# Altium schematic sheet USBINFRTransiever_Microcontroller.SchDoc
size 840 x 594 mm; DocumentNumber: ФНКЦ.542321.001 Э3; SheetNumber: 3; Format: A1
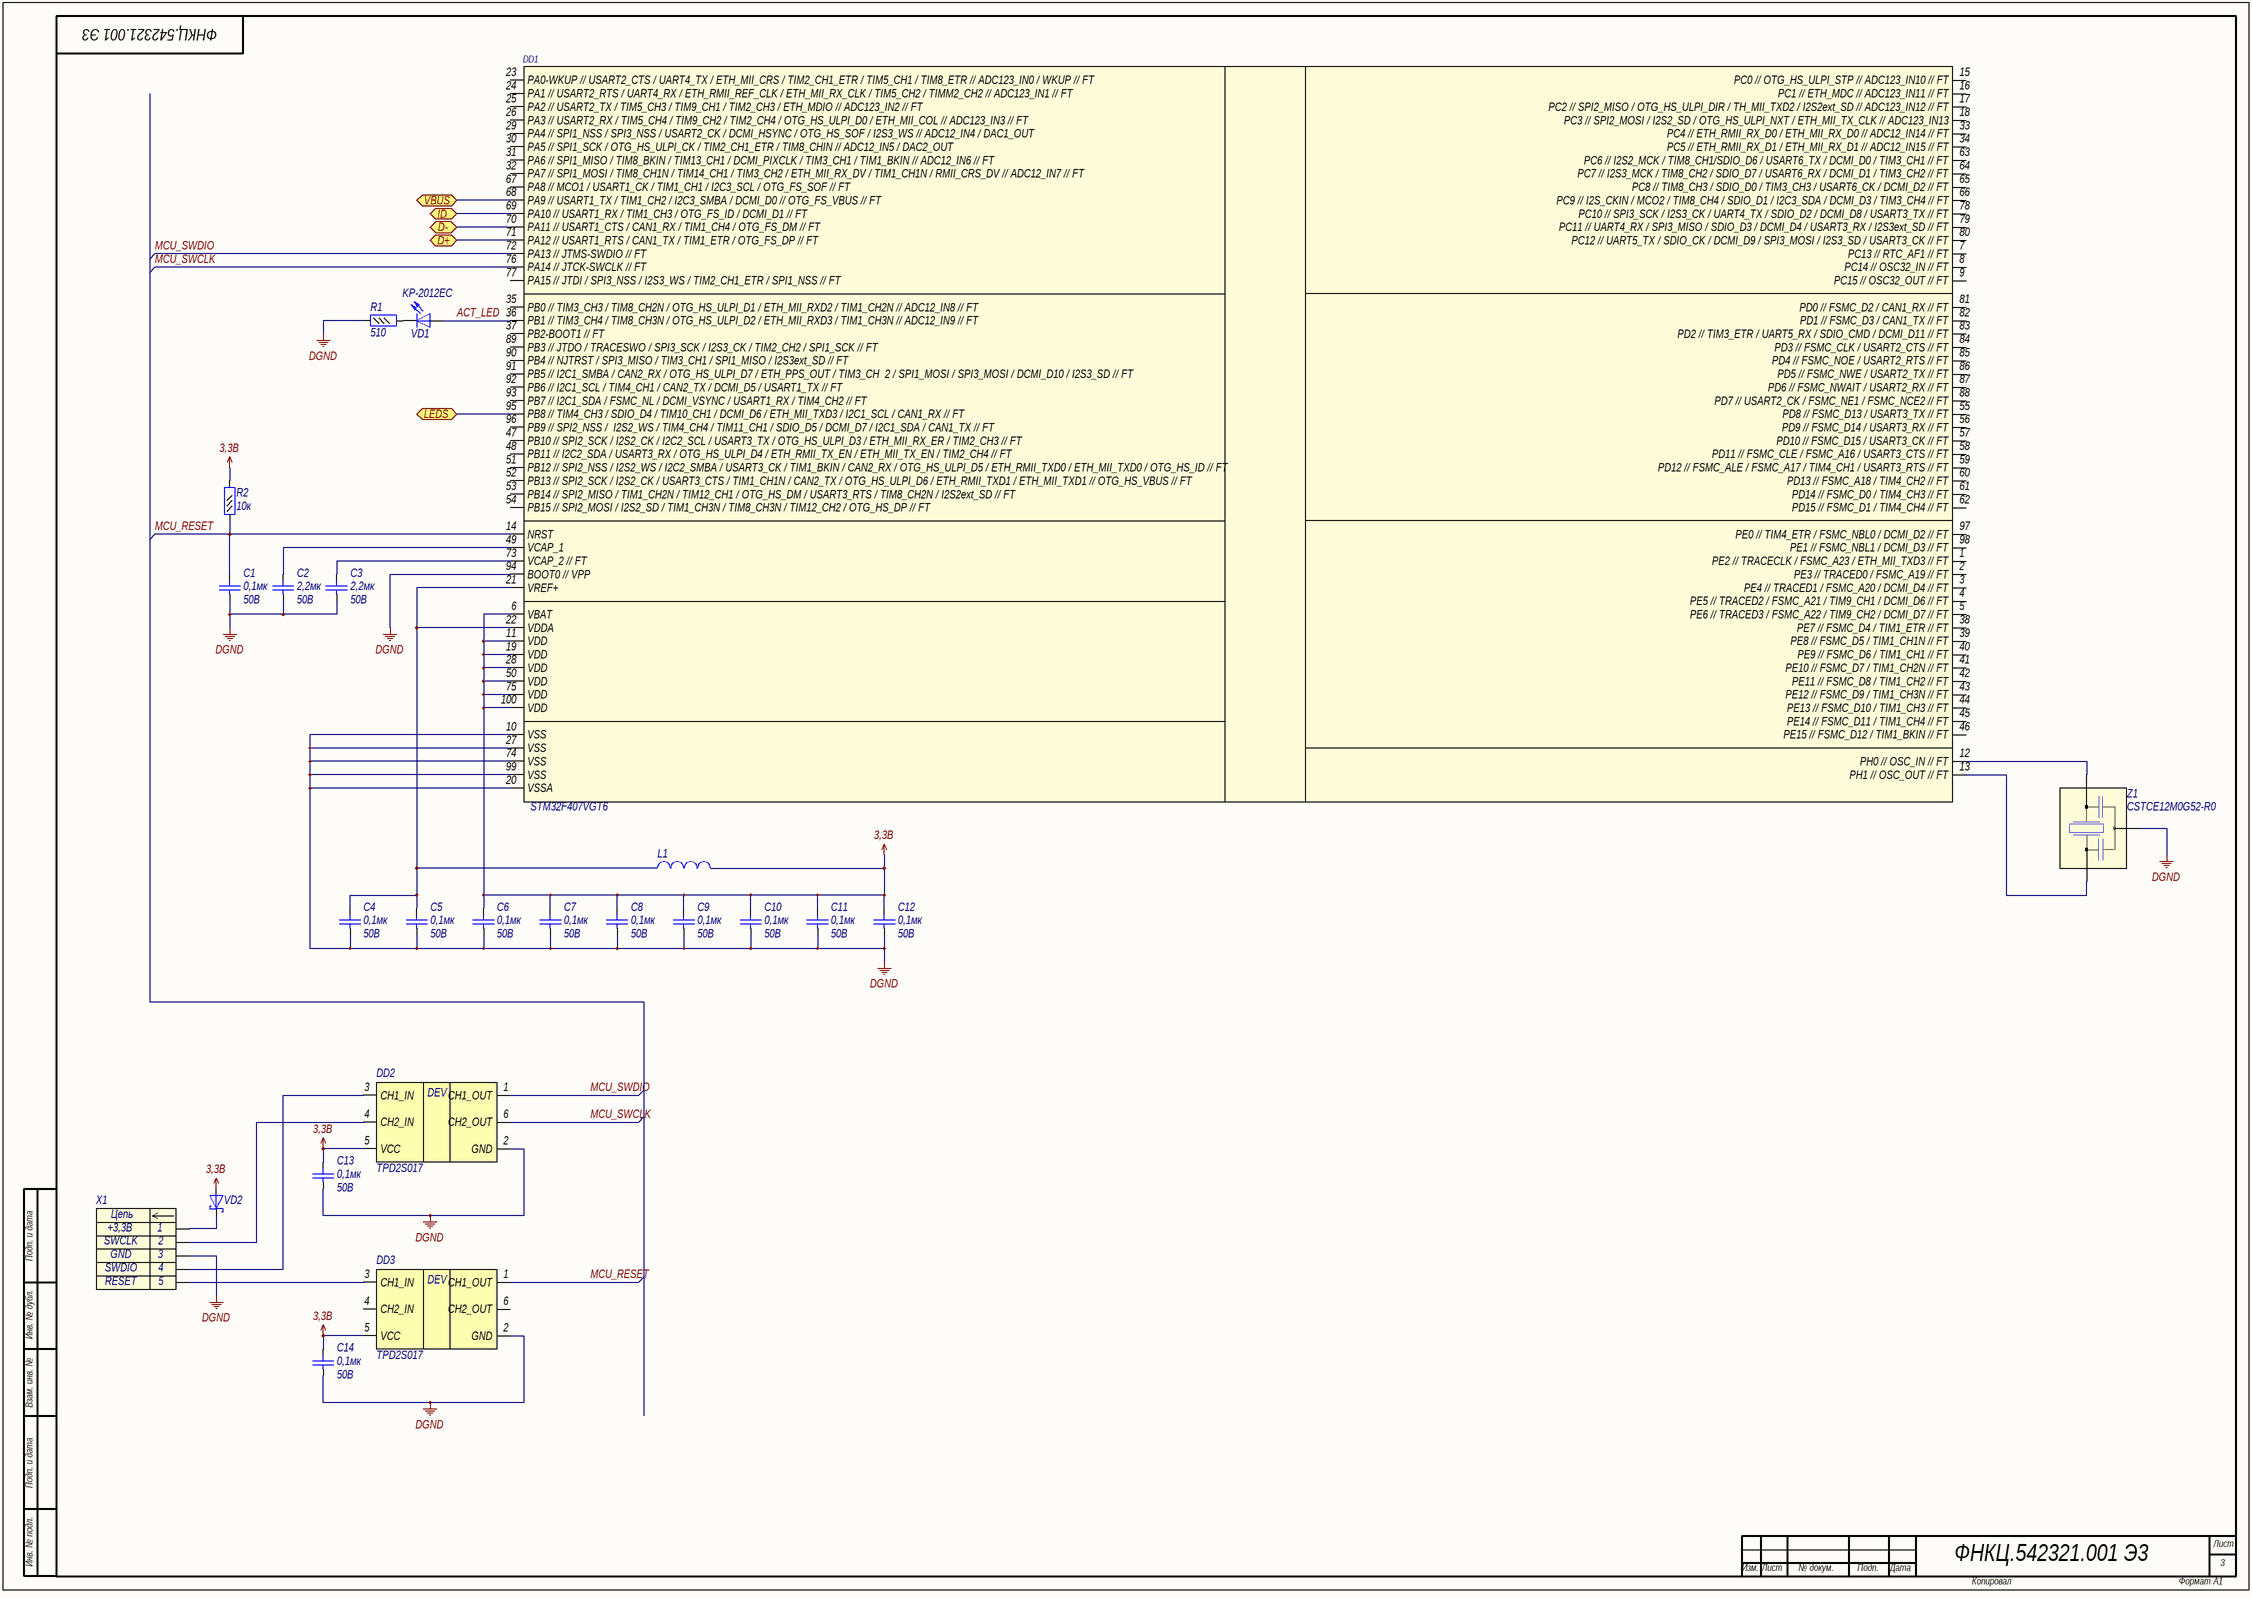
[diagram p0: USBINFRTransiever_Microcontroller.SchDoc]

## Parts
C1  value 0,1мк  Voltage: 50B  [C0603]  (hidden comment: Capacitor)
C2  value 2,2мк  Voltage: 50B  [C0603]  (hidden comment: Capacitor)
C3  value 2,2мк  Voltage: 50B  [C0603]  (hidden comment: Capacitor)
C4  value 0,1мк  Voltage: 50B  [C0603]  (hidden comment: Capacitor)
C5  value 0,1мк  Voltage: 50B  [C0603]  (hidden comment: Capacitor)
C6  value 0,1мк  Voltage: 50B  [C0603]  (hidden comment: Capacitor)
C7  value 0,1мк  Voltage: 50B  [C0603]  (hidden comment: Capacitor)
C8  value 0,1мк  Voltage: 50B  [C0603]  (hidden comment: Capacitor)
C9  value 0,1мк  Voltage: 50B  [C0603]  (hidden comment: Capacitor)
C10  value 0,1мк  Voltage: 50B  [C0603]  (hidden comment: Capacitor)
C11  value 0,1мк  Voltage: 50B  [C0603]  (hidden comment: Capacitor)
C12  value 0,1мк  Voltage: 50B  [C0603]  (hidden comment: Capacitor)
C13  value 0,1мк  Voltage: 50B  [C0603]  (hidden comment: Capacitor)
C14  value 0,1мк  Voltage: 50B  [C0603]  (hidden comment: Capacitor)
DD1  STM32F407VGT6  (value not drawn)
DD2  TPD2S017  [SOT23-6]
DD3  TPD2S017  [SOT23-6]
L1  Inductor  [L0603]  (value not drawn)
R1  value 510  [R0603]  (hidden comment: Resistor_0,062Вт)
R2  value 10к  [R0603]  (hidden comment: Resistor_0,062Вт)
VD1  Part Number: KP-2012EC  [L_0805]  (hidden comment: LED)
VD2  DiodeSchottky  [SOD-523]  (value not drawn)
X1  Header_5_plg  [PLS-5]  (value not drawn)
Z1  Part Number: CSTCE12M0G52-R0  [CSTCE]  (hidden comment: QuartzWithCaps)

## Ports
D+, D-, ID, LEDS, VBUS

## Nets
3,3B: C6.2 C7.2 C8.2 C9.2 C10.2 C11.2 C12.2 C13.2 C14.2 DD1.6(VBAT) DD1.11(VDD) DD1.19(VDD) DD1.28(VDD) DD1.50(VDD) DD1.75(VDD) DD1.100(VDD) DD2.5(VCC) DD3.5(VCC) L1.2 R2.2 VD2.2(A)
DGND: C1.1 C2.1 C3.1 C4.1 C5.1 C6.1 C7.1 C8.1 C9.1 C10.1 C11.1 C12.1 C13.1 C14.1 DD1.10(VSS) DD1.20(VSSA) DD1.27(VSS) DD1.74(VSS) DD1.94(BOOT0_//_VPP) DD1.99(VSS) DD2.2(GND) DD3.2(GND) R1.1 X1.3 Z1.2
ACT_LED: DD1.36(PB1_//_TIM3_CH4_/_TIM8_CH3N_/_OTG_HS_ULPI_D2_/_ETH_MII_RXD3_/_TIM1_CH3N_//_ADC12_IN9_//_FT) VD1.2(A)
D+: DD1.71(PA12_//_USART1_RTS_/_CAN1_TX_/_TIM1_ETR_/_OTG_FS_DP_//_FT) ; port D+
D-: DD1.70(PA11_//_USART1_CTS_/_CAN1_RX_/_TIM1_CH4_/_OTG_FS_DM_//_FT) ; port D-
ID: DD1.69(PA10_//_USART1_RX_/_TIM1_CH3_/_OTG_FS_ID_/_DCMI_D1_//_FT) ; port ID
LEDS: DD1.95(PB8_//_TIM4_CH3_/_SDIO_D4_/_TIM10_CH1_/_DCMI_D6_/_ETH_MII_TXD3_/_I2C1_SCL_/_CAN1_RX_//_FT) ; port LEDS
MCU_RESET: C1.2 DD1.14(NRST) DD3.1(CH1_OUT) R2.1
MCU_SWCLK: DD1.76(PA14_//_JTCK-SWCLK_//_FT) DD2.6(CH2_OUT)
MCU_SWDIO: DD1.72(PA13_//_JTMS-SWDIO_//_FT) DD2.1(CH1_OUT)
VBUS: DD1.68(PA9_//_USART1_TX_/_TIM1_CH2_/_I2C3_SMBA_/_DCMI_D0_//_OTG_FS_VBUS_//_FT) ; port VBUS
NetC2_2: C2.2 DD1.49(VCAP_1)
NetC3_2: C3.2 DD1.73(VCAP_2_//_FT)
NetC4_2: C4.2 C5.2 DD1.21(VREF+) DD1.22(VDDA) L1.1
NetDD1_12: DD1.12(PH0_//_OSC_IN_//_FT) Z1.3
NetDD1_13: DD1.13(PH1_//_OSC_OUT_//_FT) Z1.1
NetDD2_3: DD2.3(CH1_IN) X1.4
NetDD2_4: DD2.4(CH2_IN) X1.2
NetDD3_3: DD3.3(CH1_IN) X1.5
NetR1_2: R1.2 VD1.1(K)
NetVD2_1: VD2.1(K) X1.1

Not connected (* = marked no-connect by the designer): DD1 1(PE2_//_TRACECLK_/_FSMC_A23_/_ETH_MII_TXD3_//_FT) 2(PE3_//_TRACED0_/_FSMC_A19_//_FT) 3(PE4_//_TRACED1_/_FSMC_A20_/_DCMI_D4_//_FT) 4(PE5_//_TRACED2_/_FSMC_A21_/_TIM9_CH1_/_DCMI_D6_//_FT) 5(PE6_//_TRACED3_/_FSMC_A22_/_TIM9_CH2_/_DCMI_D7_//_FT) 7(PC13_//_RTC_AF1_//_FT) 8(PC14_//_OSC32_IN_//_FT) 9(PC15_//_OSC32_OUT_//_FT) 15(PC0_//_OTG_HS_ULPI_STP_//_ADC123_IN10_//_FT) 16(PC1_//_ETH_MDC_//_ADC123_IN11_//_FT) 17(PC2_//_SPI2_MISO_/_OTG_HS_ULPI_DIR_/_TH_MII_TXD2_/_I2S2ext_SD_//_ADC123_IN12_//_FT) 18(PC3_//_SPI2_MOSI_/_I2S2_SD_/_OTG_HS_ULPI_NXT_/_ETH_MII_TX_CLK_//_ADC123_IN13) 23(PA0-WKUP_//_USART2_CTS_/_UART4_TX_/_ETH_MII_CRS_/_TIM2_CH1_ETR_/_TIM5_CH1_/_TIM8_ETR_//_ADC123_IN0_/_WKUP_//_FT) 24(PA1_//_USART2_RTS_/_UART4_RX_/_ETH_RMII_REF_CLK_/_ETH_MII_RX_CLK_/_TIM5_CH2_/_TIMM2_CH2_//_ADC123_IN1_//_FT) 25(PA2_//_USART2_TX_/_TIM5_CH3_/_TIM9_CH1_/_TIM2_CH3_/_ETH_MDIO_//_ADC123_IN2_//_FT) 26(PA3_//_USART2_RX_/_TIM5_CH4_/_TIM9_CH2_/_TIM2_CH4_/_OTG_HS_ULPI_D0_/_ETH_MII_COL_//_ADC123_IN3_//_FT) 29(PA4_//_SPI1_NSS_/_SPI3_NSS_/_USART2_CK_/_DCMI_HSYNC_/_OTG_HS_SOF_/_I2S3_WS_//_ADC12_IN4_/_DAC1_OUT) 30(PA5_//_SPI1_SCK_/_OTG_HS_ULPI_CK_/_TIM2_CH1_ETR_/_TIM8_CHIN_//_ADC12_IN5_/_DAC2_OUT) 31(PA6_//_SPI1_MISO_/_TIM8_BKIN_/_TIM13_CH1_/_DCMI_PIXCLK_/_TIM3_CH1_/_TIM1_BKIN_//_ADC12_IN6_//_FT) 32(PA7_//_SPI1_MOSI_/_TIM8_CH1N_/_TIM14_CH1_/_TIM3_CH2_/_ETH_MII_RX_DV_/_TIM1_CH1N_/_RMII_CRS_DV_//_ADC12_IN7_//_FT) 33(PC4_//_ETH_RMII_RX_D0_/_ETH_MII_RX_D0_//_ADC12_IN14_//_FT) 34(PC5_//_ETH_RMII_RX_D1_/_ETH_MII_RX_D1_//_ADC12_IN15_//_FT) 35(PB0_//_TIM3_CH3_/_TIM8_CH2N_/_OTG_HS_ULPI_D1_/_ETH_MII_RXD2_/_TIM1_CH2N_//_ADC12_IN8_//_FT) 37(PB2-BOOT1_//_FT) 38(PE7_//_FSMC_D4_/_TIM1_ETR_//_FT) 39(PE8_//_FSMC_D5_/_TIM1_CH1N_//_FT) 40(PE9_//_FSMC_D6_/_TIM1_CH1_//_FT) 41(PE10_//_FSMC_D7_/_TIM1_CH2N_//_FT) 42(PE11_//_FSMC_D8_/_TIM1_CH2_//_FT) 43(PE12_//_FSMC_D9_/_TIM1_CH3N_//_FT) 44(PE13_//_FSMC_D10_/_TIM1_CH3_//_FT) 45(PE14_//_FSMC_D11_/_TIM1_CH4_//_FT) 46(PE15_//_FSMC_D12_/_TIM1_BKIN_//_FT) 47(PB10_//_SPI2_SCK_/_I2S2_CK_/_I2C2_SCL_/_USART3_TX_/_OTG_HS_ULPI_D3_/_ETH_MII_RX_ER_/_TIM2_CH3_//_FT) 48(PB11_//_I2C2_SDA_/_USART3_RX_/_OTG_HS_ULPI_D4_/_ETH_RMII_TX_EN_/_ETH_MII_TX_EN_/_TIM2_CH4_//_FT) 51(PB12_//_SPI2_NSS_/_I2S2_WS_/_I2C2_SMBA_/_USART3_CK_/_TIM1_BKIN_/_CAN2_RX_/_OTG_HS_ULPI_D5_/_ETH_RMII_TXD0_/_ETH_MII_TXD0_/_OTG_HS_ID_//_FT) 52(PB13_//_SPI2_SCK_/_I2S2_CK_/_USART3_CTS_/_TIM1_CH1N_/_CAN2_TX_/_OTG_HS_ULPI_D6_/_ETH_RMII_TXD1_/_ETH_MII_TXD1_//_OTG_HS_VBUS_//_FT) 53(PB14_//_SPI2_MISO_/_TIM1_CH2N_/_TIM12_CH1_/_OTG_HS_DM_/_USART3_RTS_/_TIM8_CH2N_/_I2S2ext_SD_//_FT) 54(PB15_//_SPI2_MOSI_/_I2S2_SD_/_TIM1_CH3N_/_TIM8_CH3N_/_TIM12_CH2_/_OTG_HS_DP_//_FT) 55(PD8_//_FSMC_D13_/_USART3_TX_//_FT) 56(PD9_//_FSMC_D14_/_USART3_RX_//_FT) 57(PD10_//_FSMC_D15_/_USART3_CK_//_FT) 58(PD11_//_FSMC_CLE_/_FSMC_A16_/_USART3_CTS_//_FT) 59(PD12_//_FSMC_ALE_/_FSMC_A17_/_TIM4_CH1_/_USART3_RTS_//_FT) 60(PD13_//_FSMC_A18_/_TIM4_CH2_//_FT) 61(PD14_//_FSMC_D0_/_TIM4_CH3_//_FT) 62(PD15_//_FSMC_D1_/_TIM4_CH4_//_FT) 63(PC6_//_I2S2_MCK_/_TIM8_CH1/SDIO_D6_/_USART6_TX_/_DCMI_D0_/_TIM3_CH1_//_FT) 64(PC7_//_I2S3_MCK_/_TIM8_CH2_/_SDIO_D7_/_USART6_RX_/_DCMI_D1_/_TIM3_CH2_//_FT) 65(PC8_//_TIM8_CH3_/_SDIO_D0_/_TIM3_CH3_/_USART6_CK_/_DCMI_D2_//_FT) 66(PC9_//_I2S_CKIN_/_MCO2_/_TIM8_CH4_/_SDIO_D1_/_I2C3_SDA_/_DCMI_D3_/_TIM3_CH4_//_FT) 67(PA8_//_MCO1_/_USART1_CK_/_TIM1_CH1_/_I2C3_SCL_/_OTG_FS_SOF_//_FT) 77(PA15_//_JTDI_/_SPI3_NSS_/_I2S3_WS_/_TIM2_CH1_ETR_/_SPI1_NSS_//_FT) 78(PC10_//_SPI3_SCK_/_I2S3_CK_/_UART4_TX_/_SDIO_D2_/_DCMI_D8_/_USART3_TX_//_FT) 79(PC11_//_UART4_RX_/_SPI3_MISO_/_SDIO_D3_/_DCMI_D4_/_USART3_RX_/_I2S3ext_SD_//_FT) 80(PC12_//_UART5_TX_/_SDIO_CK_/_DCMI_D9_/_SPI3_MOSI_/_I2S3_SD_/_USART3_CK_//_FT) 81(PD0_//_FSMC_D2_/_CAN1_RX_//_FT) 82(PD1_//_FSMC_D3_/_CAN1_TX_//_FT) 83(PD2_//_TIM3_ETR_/_UART5_RX_/_SDIO_CMD_/_DCMI_D11_//_FT) 84(PD3_//_FSMC_CLK_/_USART2_CTS_//_FT) 85(PD4_//_FSMC_NOE_/_USART2_RTS_//_FT) 86(PD5_//_FSMC_NWE_/_USART2_TX_//_FT) 87(PD6_//_FSMC_NWAIT_/_USART2_RX_//_FT) 88(PD7_//_USART2_CK_/_FSMC_NE1_/_FSMC_NCE2_//_FT) 89(PB3_//_JTDO_/_TRACESWO_/_SPI3_SCK_/_I2S3_CK_/_TIM2_CH2_/_SPI1_SCK_//_FT) 90(PB4_//_NJTRST_/_SPI3_MISO_/_TIM3_CH1_/_SPI1_MISO_/_I2S3ext_SD_//_FT) 91(PB5_//_I2C1_SMBA_/_CAN2_RX_/_OTG_HS_ULPI_D7_/_ETH_PPS_OUT_/_TIM3_CH__2_/_SPI1_MOSI_/_SPI3_MOSI_/_DCMI_D10_/_I2S3_SD_//_FT) 92(PB6_//_I2C1_SCL_/_TIM4_CH1_/_CAN2_TX_/_DCMI_D5_/_USART1_TX_//_FT) 93(PB7_//_I2C1_SDA_/_FSMC_NL_/_DCMI_VSYNC_/_USART1_RX_/_TIM4_CH2_//_FT) 96(PB9_//_SPI2_NSS_/__I2S2_WS_/_TIM4_CH4_/_TIM11_CH1_/_SDIO_D5_/_DCMI_D7_/_I2C1_SDA_/_CAN1_TX_//_FT) 97(PE0_//_TIM4_ETR_/_FSMC_NBL0_/_DCMI_D2_//_FT) 98(PE1_//_FSMC_NBL1_/_DCMI_D3_//_FT); DD3 4(CH2_IN) 6(CH2_OUT)

## Notes on the sheet
- Подп. и дата
- Инв. № дубл.
- Взам. инв. №
- Инв. № подл.
- Лист
- Изм.
- № докум.
- Подп.
- Дата
- Копировал
- Формат
- (in symbol connect6) Цепь
- (in symbol diode20) DEV

## Library data of the parts
C1 C4-C14 = cap131: Конденсатор; Part Name: Ceramic; Manufacture: Murata; Part Number: GRM188R71H104K; id: cap131; TKE: X7R
C2 C3 = cap135: Конденсатор; Part Name: Ceramic; Manufacture: Murata; Part Number: GRM188R71A225KE15D; id: cap135; TKE: X7R
DD1 = STM32F407VGT6: Микроконтроллер STM32F407VGT6
DD2 DD3 = diode20: EMI Filter; Part Name: ESD Suppressors; Part Number: TPD2S017DBVR; Manufacture: Texas Instruments; Max Reverse Voltage: 12B; Capacitance: 1pF; Number of Channels: 2; id: diode20
L1 = ind0: EMI Suppression Filter; Part Name: EMI Suppression Filters; Part Number: BLM18PG181SN1D; Rated Current: 1,5A; id: ind0; Resistance: 0,09Ohm
R1 = res452: Резистор; Manufacture: Yageo; Part Number: RC0603FR-07510RL; id: res452; Accuracy: 1%; Part Name: Resistor; Power: 0,062Вт
R2 = res483: Резистор; Manufacture: Yageo; Part Number: RC0603FR-0710KL; id: res483; Accuracy: 1%; Part Name: Resistor; Power: 0,062Вт
VD1 = diode8: Светодиод; id: diode8; Part Name: LED
VD2 = diode21: Диод Шоттки; Part Number: PMEG2010AEB.115; Manufacture: NXP Semiconductor; Max Reverse Voltage: 20B; Forward Voltage: 0,62B; Forward Current: 1А; Breakdown Current: 600uA; Capacitance: 25pF; Number of Channels: 1; id: diode21; Part Name: Diode Schottky
X1 = connect6: Разъем - 5 конт. вилка; Part Number: DS1021-1*5SF112-B; Manufacture: Ningbo connfly electronic; Contact_1: +3,3B; Contact_2: SWCLK; Contact_3: GND; Contact_4: SWDIO; Contact_5: RESET; Etch: 2,54mm; Part Name: PLS-5; id: connect6
Z1 = crystal5: Кварцевый резорнатор со встроенными нагрузочными конденсаторами; Manufacture: Murata; Frequence: 12MHz; id: crystal5